# EAGLE design power-supply-tests (EAGLE 9.6.2)
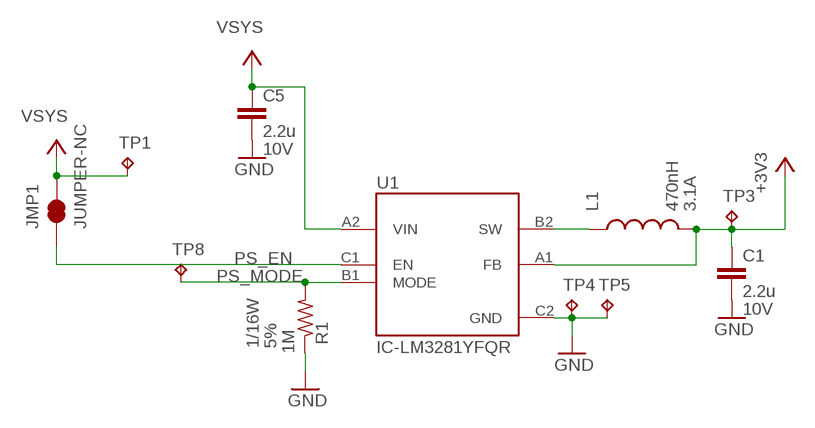
[diagram p0: schematic, sheet 1]

## Parts
C1  2.2u  CAP-2.2U-10V-01-0603  [C0603]
C5  2.2u  CAP-2.2U-10V-01-0603  [C0603]
JMP1  JUMPER-NC  [JUMPER-ROUND-NC]
L1  470nH  IND-3.1A-60MOHM-0805  [INDC2012X100N]
R1  1M  RES-1M-5%-0402  [R0402-M]
TP1  HEADER-1  [CON-HEADER-1X1-POGO-1P9]
TP3  HEADER-1  [CON-HEADER-1X1-POGO-1P9]
TP4  HEADER-1  [CON-HEADER-1X1-POGO-1P9]
TP5  HEADER-1  [CON-HEADER-1X1-POGO-1P9]
TP8  HEADER-1  [CON-HEADER-1X1-POGO-1P9]
U1  IC-LM3281YFQR  [BGA6N40P2X3_116X143X67N]

## Nets
+3V3: C1.1 L1.2 TP3.1(TP) U1.A1(FB)
GND: C1.2 C5.2 R1.1 TP4.1(TP) TP5.1(TP) U1.C2(GND)
PS_EN: JMP1.P$1 U1.C1(EN)
PS_MODE: R1.2 TP8.1(TP) U1.B1(MODE)
PS_SW1: L1.1 U1.B2(SW)
VSYS: C5.1 JMP1.P$2 TP1.1(TP) U1.A2(VIN)

## Library data of the parts
C1 C5 = wolff-den:CAP: CAPACITOR; DESC: CAP CER 2.2UF 10V X7R 0603; DIGIKEYPN: 490-4520-1-ND; MPN: GRM188R71A225KE15D; TEMPHIGH: 125; TEMPLOW: -55; VOLTHIGH: 10V
JMP1 = wolff-den:JUMPER-NC
L1 = wolff-den:IND: INDUCTOR; CURRENT: 3.1A; DESC: FIXED IND 470NH 3.1A 50 MOHM SMD; DIGIKEYPN: ‎490-17698-1-ND‎; MF: Murata; MPN: LQM21PNR47MGHL‎
R1 = wolff-den:RES: RESISTOR; DESC: RES SMD 1M OHM 5% 1/16W 0402; DIGIKEYPN: 311-1.0MJRCT-ND; MPN: RC0402JR-071ML; POWER: 1/16W; TOLERANCE: 5%
TP1 TP3-TP5 TP8 = wolff-den:HEADER-1
U1 = wolff-den:IC-LM3281YFQR: 3.3-V, 1.2-A, 6-MHz Mini Step-Down DC-DC Converter 6-DSBGA -30 to 90 Check prices <https://pricing.snapeda.com/parts/LM3281YFQR/Texas%20Instruments/view-part?ref=eda>; DESC: 3.3-V, 1.2-A, 6-MHz Mini Step-Down DC-DC Converter 6-DSBGA -30 to 90; MF: Texas Instruments; MPN: LM3281YFQR

## Board
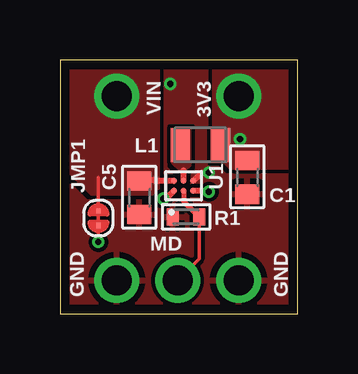
[diagram p1: board, top side]
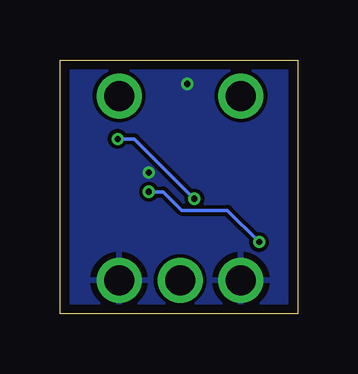
[diagram p2: board, bottom side, seen from below]

Size 9.9 x 10.6 mm. Coordinates in mm from the lower left corner, seen from the top.
Outline: 0,0 9.9,0 9.9,10.6 0,10.6 0,0
Copper layers (1*16): Top 0.035559375mm / dielectric 1.6mm / Bottom 0.035559375mm
Design rules "oshpark-2layer-modified": minimum track width 6mil, minimum drill 10mil, track to track 6mil, track to pad 6mil, pad to pad 6mil, via to via 6mil, smd to smd 6mil, copper to edge 15mil, drill to drill 6mil, minimum pad ring 5mil, minimum via ring 5mil, stop-mask expansion 2.5mil, vias tented up to drill 0.45mm, thermal gap 10mil

### Footprints (pad centres in the part's own frame; a part is rotated, then mirrored left to right if it is on the bottom)
C0603 = smd 0.8 x 1: 1 -0.7,0; 2 0.7,0
JUMPER-ROUND-NC = smd 0.2 x 0.2: P$1 -0.3,0; P$2 0.3,0
INDC2012X100N = smd 0.8 x 1.42: 1 -0.835,0; 2 0.835,0
R0402-M = smd 0.5 x 0.7: 1 -0.55,0; 2 0.55,0
CON-HEADER-1X1-POGO-1P9 = drill 1.25: 1 0,0
BGA6N40P2X3_116X143X67N = smd 0.25 x 0.25: A1 -0.2,0.4; A2 0.2,0.4; B1 -0.2,0; B2 0.2,0; C1 -0.2,-0.4; C2 0.2,-0.4

### Placement (x,y rotation side)
C1  7.8,5.7 270 top
C5  3.3,4.85 270 top
JMP1  1.6,4 90 top
L1  5.85,7.05 0 top
R1  5.25,4.05 0 top
TP1  2.36,9.1 0 top
TP3  7.44,9.1 0 top
TP4  2.36,1.4 0 top
TP5  7.44,1.4 0 top
TP8  4.9,1.4 0 top
U1  5.15,5.35 90 top

### Tracks (layer width: path | path; a pad name or v marks a point on that pad's centre or on a via)
+3V3  (via drill 0.25)
  Top 0.254: U1.A1 4.41,4.81 v4.3,4.81
  Bottom 0.152: v4.3,4.81 v4.31,4.81 6.8,7.3 v7.5,7.3
  pour Top (no thermals): 7.1,6.1 6.4,6.8 6.4,10.6 9.9,10.6 9.9,6.1
GND  (via drill 0.25)
  Top 0.254: U1.C2 5.9,5.9 6,5.9
  other vias: 6.2,5.9 4.6,9.6
  pour Top (rank 2): 0,10.6 0,0 9.9,0 9.9,10.6
  pour Bottom: 0,10.6 0,0 9.9,0 9.9,10.6
PS_EN  (via drill 0.25)
  Top 0.152: JMP1.P$1 v1.6,3
  Top 0.254: U1.C1 6.15,5.15 v6.2,5.1
  Bottom 0.152: v6.2,5.1 5.6,5.1 4.83,4.32 2.92,4.32 v1.6,3
PS_MODE
  Top 0.152: R1.2 5.8,2.3 TP8.1
  Top 0.203: U1.B1 5.15,4.7 R1.2
PS_SW1
  Top 0.254: U1.B2 5.15,6
  pour Top (no thermals): 5,6 4.7,6.3 4.7,7.7 5.4,7.7 5.4,6.2 5.2,6
VSYS
  Top 0.152: JMP1.P$2 1.6,5.7
  Top 0.254: U1.A2 3.95,5.55 3.9,5.6
  pour Top (no thermals): 4.1,5 1.3,5 0,6.3 0,10.6 4.1,10.6

### Text on the board
tPlace: VIN | 3V3 | MD | GND | GND